# EAGLE schematic PA (EAGLE 9.1.3)
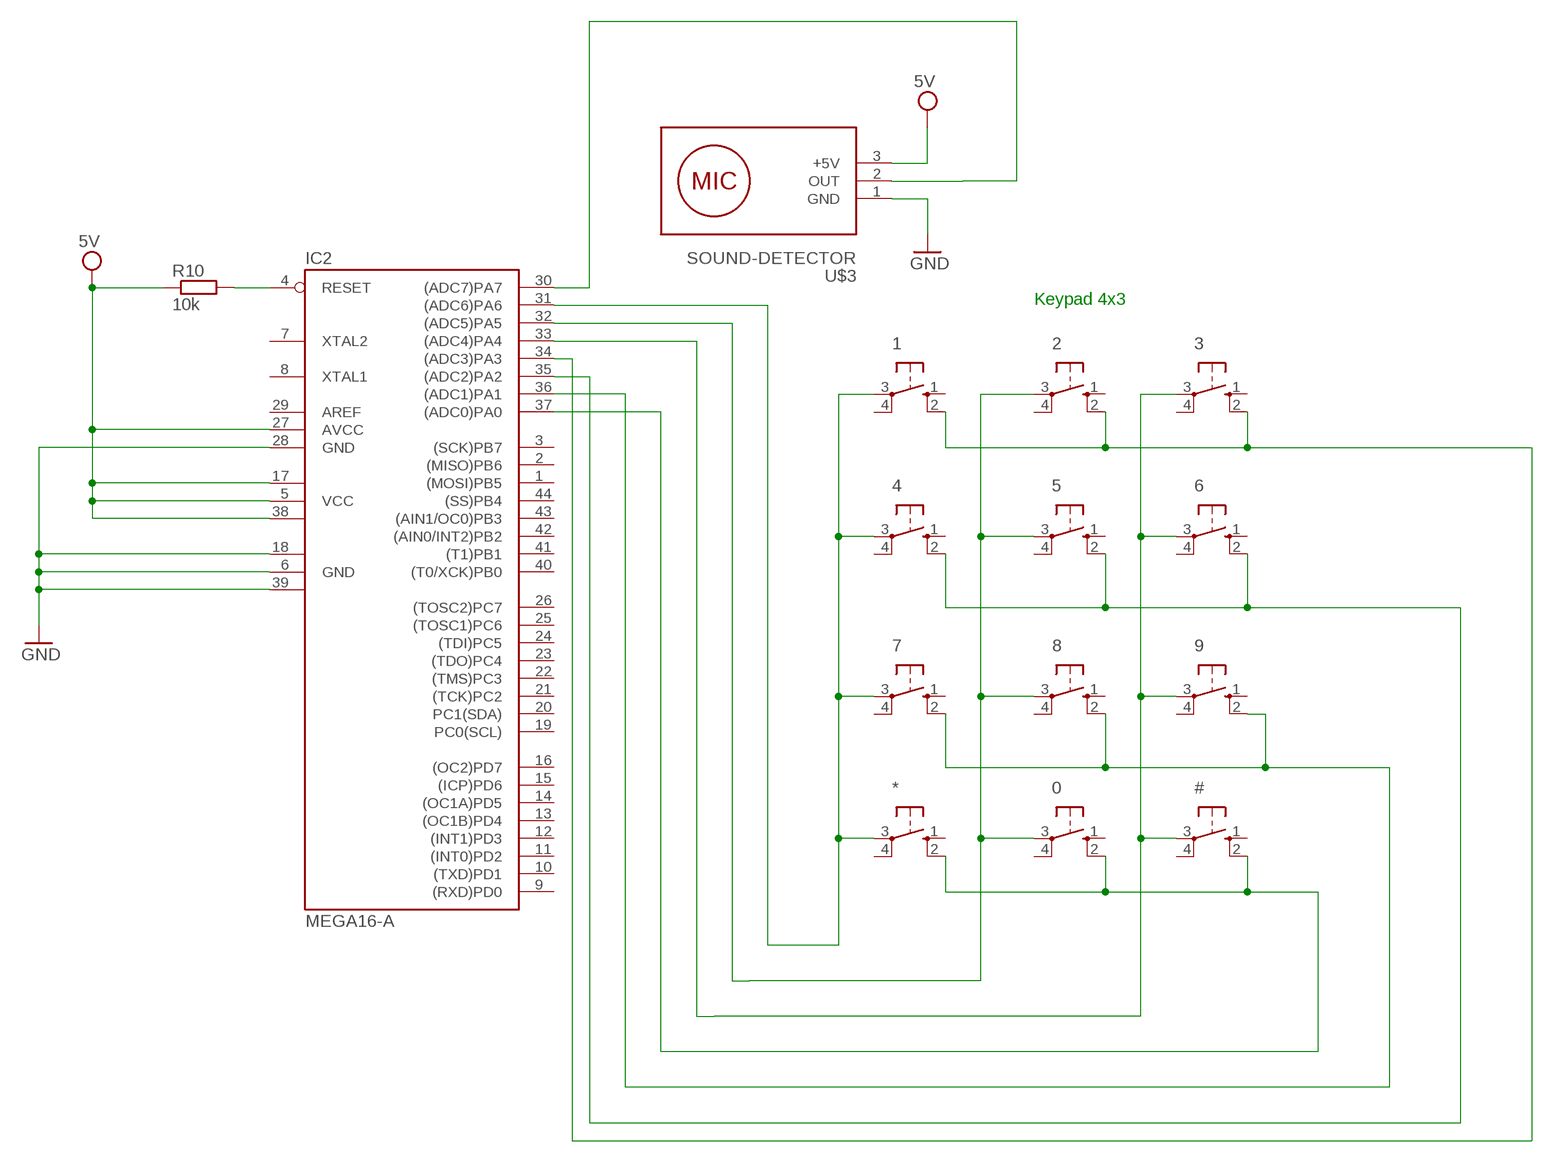
[diagram p0: schematic, sheet 1]

## Parts
0  40/XX  [B3F/40XX]
1  40/XX  [B3F/40XX]
2  40/XX  [B3F/40XX]
3  40/XX  [B3F/40XX]
4  40/XX  [B3F/40XX]
5  40/XX  [B3F/40XX]
6  40/XX  [B3F/40XX]
7  40/XX  [B3F/40XX]
8  40/XX  [B3F/40XX]
9  40/XX  [B3F/40XX]
#  40/XX  [B3F/40XX]
*  40/XX  [B3F/40XX]
IC2  MEGA16-A  [TQFP44]
R10  10k  R-EU_M0805  [M0805]
U$3  SOUND-DETECTOR  [SOUND-DETECTOR]

## Nets
GND: IC2.6(GND) IC2.18(GND1) IC2.28(GND) IC2.39(GND2) U$3.1(GND)
N$2: 1.2(S1) 2.2(S1) 3.2(S1) IC2.34((ADC3)PA3)
N$32: IC2.4(RESET) R10.2
N$33: IC2.30((ADC7)PA7) U$3.2(OUT)
N$34: 1.3(P) 4.3(P) 7.3(P) *.3(P) IC2.31((ADC6)PA6)
N$35: 0.3(P) 2.3(P) 5.3(P) 8.3(P) IC2.32((ADC5)PA5)
N$36: 3.3(P) 6.3(P) 9.3(P) #.3(P) IC2.33((ADC4)PA4)
N$38: 4.2(S1) 5.2(S1) 6.2(S1) IC2.35((ADC2)PA2)
N$39: 7.2(S1) 8.2(S1) 9.2(S1) IC2.36((ADC1)PA1)
N$40: 0.2(S1) #.2(S1) *.2(S1) IC2.37((ADC0)PA0)
VCC: IC2.5(VCC) IC2.17(VCC1) IC2.27(AVCC) IC2.38(VCC2) R10.1 U$3.3(+5V) ; supply symbol labelled 5V
Unconnected: 0.1(S) 0.4(P1) 1.1(S) 1.4(P1) 2.1(S) 2.4(P1) 3.1(S) 3.4(P1) 4.1(S) 4.4(P1) 5.1(S) 5.4(P1) 6.1(S) 6.4(P1) 7.1(S) 7.4(P1) 8.1(S) 8.4(P1) 9.1(S) 9.4(P1) #.1(S) #.4(P1) *.1(S) *.4(P1) IC2.1((MOSI)PB5) IC2.2((MISO)PB6) IC2.3((SCK)PB7) IC2.7(XTAL2) IC2.8(XTAL1) IC2.9((RXD)PD0) IC2.10((TXD)PD1) IC2.11((INT0)PD2) IC2.12((INT1)PD3) IC2.13((OC1B)PD4) IC2.14((OC1A)PD5) IC2.15((ICP)PD6) IC2.16((OC2)PD7) IC2.19(PC0(SCL)) IC2.20(PC1(SDA)) IC2.21((TCK)PC2) IC2.22((TMS)PC3) IC2.23((TDO)PC4) IC2.24((TDI)PC5) IC2.25((TOSC1)PC6) IC2.26((TOSC2)PC7) IC2.29(AREF) IC2.40((T0/XCK)PB0) IC2.41((T1)PB1) IC2.42((AIN0/INT2)PB2) IC2.43((AIN1/OC0)PB3) IC2.44((SS)PB4)

## Notes on the sheet
- Keypad 4x3

## Library data of the parts
0 1-9 # * = switch-omron:40/XX: OMRON SWITCH; OC_FARNELL: unknown; OC_NEWARK: unknown
IC2 = atmel:MEGA16: MICROCONTROLLER 16 Kbytes FLASH 1 kbytes SRAM 512 bytes EEPROM USART 8-channel 10 bit ADC Source: avr.lbr; MPN: ATMEGA16-16AU; OC_FARNELL: 9171134; OC_NEWARK: 96K6515
R10 = rcl:R-EU_: RESISTOR, European symbol; SPICEPREFIX: R
U$3 = diy-modules:SOUND-DETECTOR: Sound Detection Module